# EasyEDA Pro project ProProject_Hi3861_v2.1_2024-07-26.epro, schematic Schematic2

## Sheets
1 P1: Create Date: 2024-07-16; Page Name: P1; Project Name: Hi3861_v2.1; Schematic Name: Schematic2; Update Date: 2024-07-25; Company: 嘉立创EDA; Page Size: A4; Version: V1.0
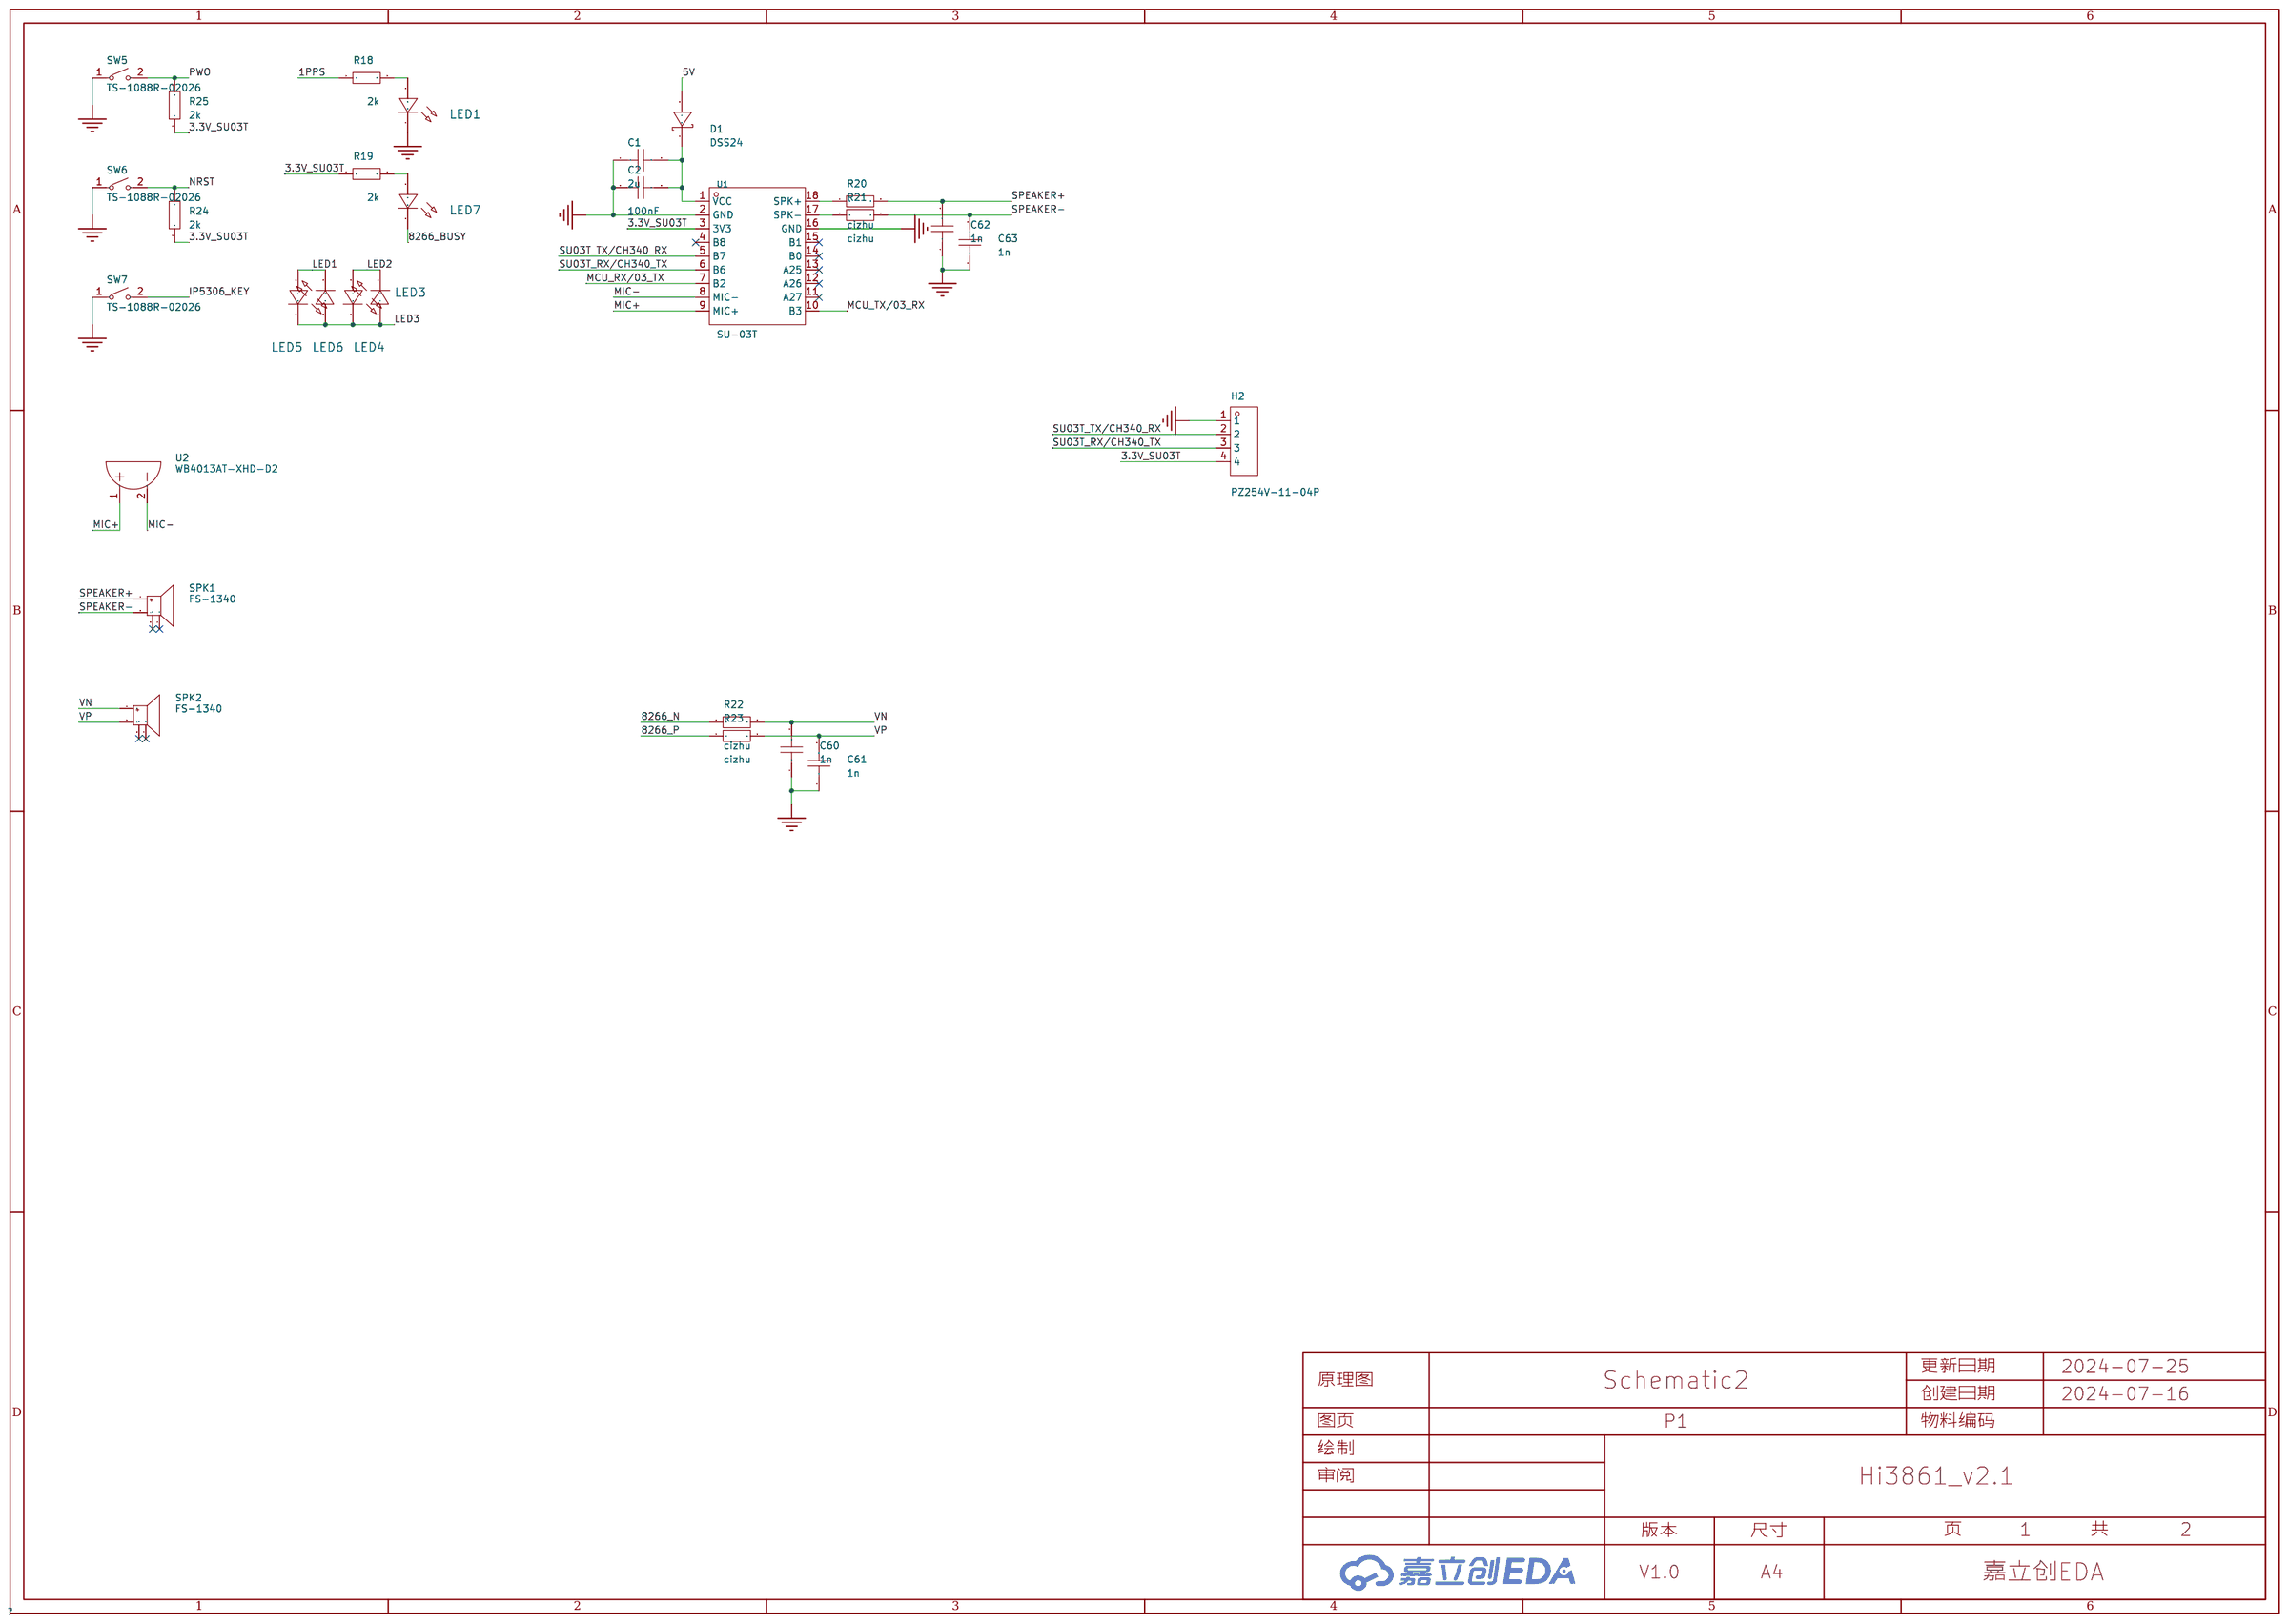
[diagram p2: P1]
2 P2: Page Name: P2
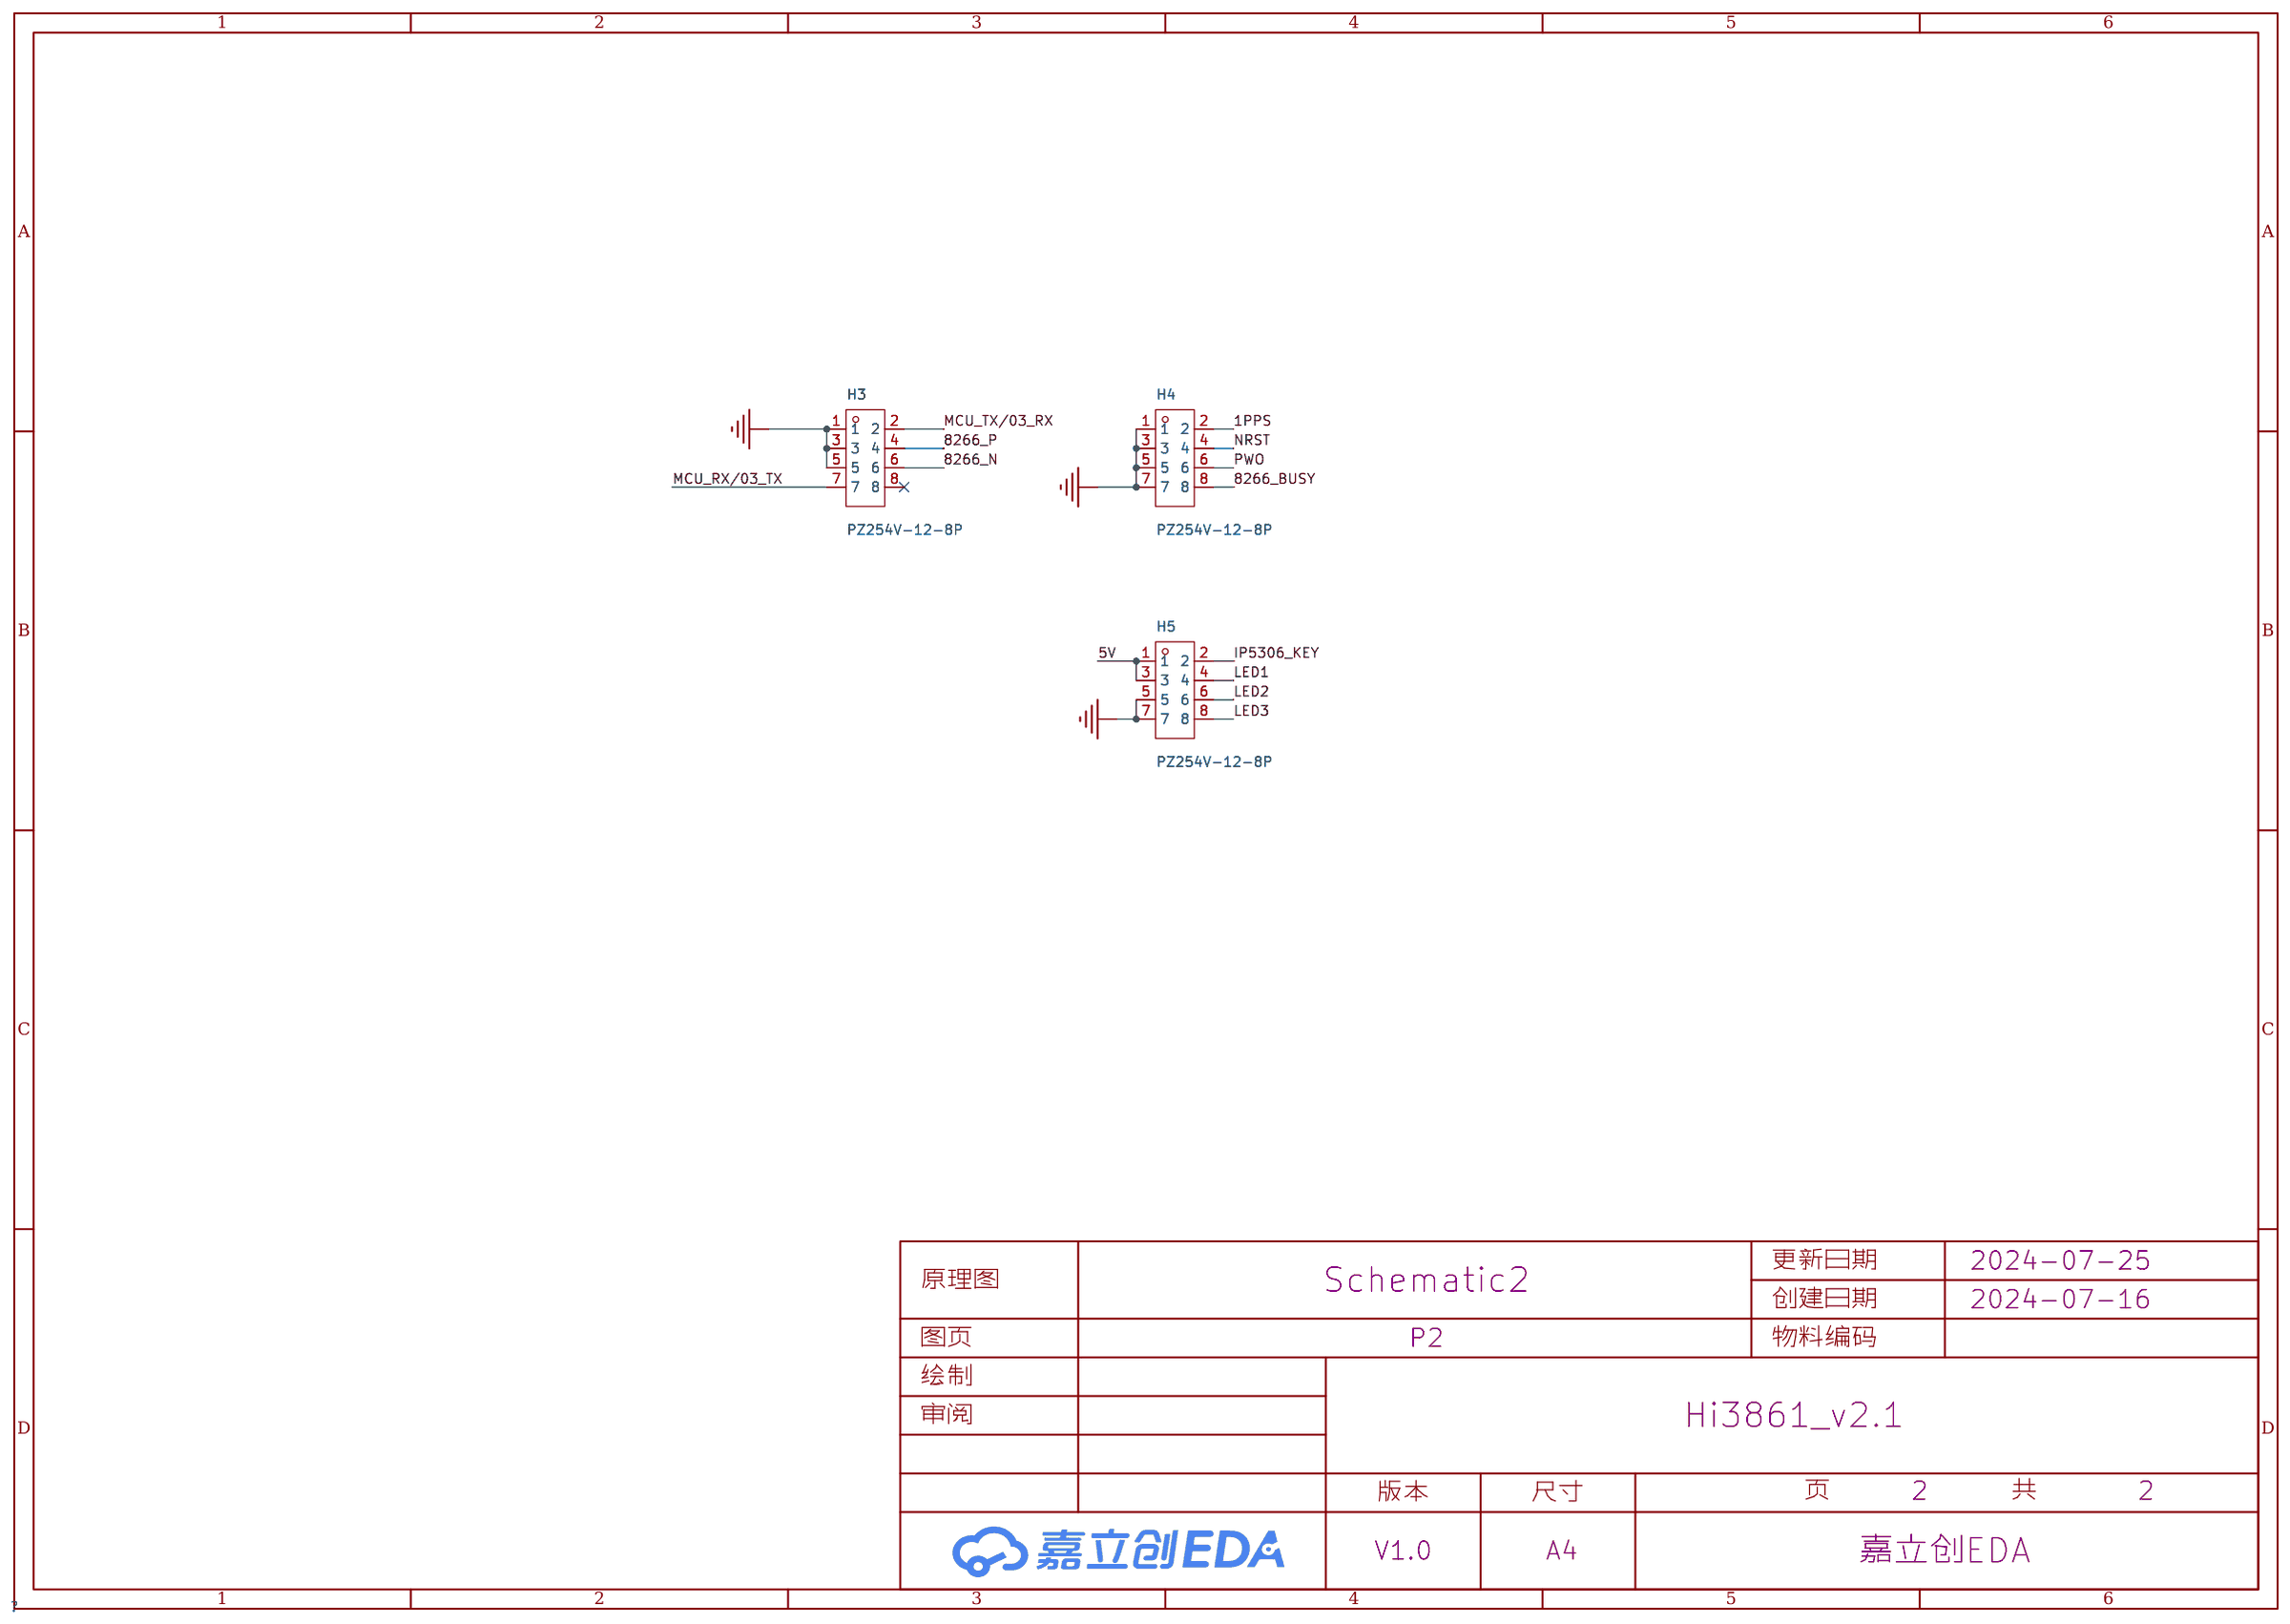
[diagram p3: P2]

## Parts
sheet P1
C1  2u  [C0402]
C2  100nF  [C0402]
C60  1n  [C0402]
C61  1n  [C0402]
C62  1n  [C0402]
C63  1n  [C0402]
D1  DSS24  [SOD-123_L2.8-W1.8-LS3.7-RD]
H2  PZ254V-11-04P  [HDR-TH_4P-P2.54-V-M]
LED1  -  [LED_0603]
LED3  -  [LED_0603]
LED4  -  [LED_0603]
LED5  -  [LED_0603]
LED6  -  [LED_0603]
LED7  -  [LED_0603]
R18  2k  [R0402]
R19  2k  [R0402]
R20  cizhu  [R0603]
R21  cizhu  [R0603]
R22  cizhu  [R0603]
R23  cizhu  [R0603]
R24  2k  [R0402]
R25  2k  [R0402]
SPK1  FS-1340  [BUZ-SMD_4P-L13.0-W13.0-P11.4-BL]
SPK2  FS-1340  [BUZ-SMD_4P-L13.0-W13.0-P11.4-BL]
SW5  TS-1088R-02026  [SW-SMD_L3.9-W3.0-P4.45]
SW6  TS-1088R-02026  [SW-SMD_L3.9-W3.0-P4.45]
SW7  TS-1088R-02026  [SW-SMD_L3.9-W3.0-P4.45]
U1  SU-03T  [COMM-SMD_18P-L21.0-W15.0-P2.00]
U2  WB4013AT-XHD-D2  [MIC-SMD_BD4.0_MIC.X-4013-SMD]
sheet P2
H3  PZ254V-12-8P  [HDR-TH_8P-P2.54-V-M-R2-C4-S2.54]
H4  PZ254V-12-8P  [HDR-TH_8P-P2.54-V-M-R2-C4-S2.54]
H5  PZ254V-12-8P  [HDR-TH_8P-P2.54-V-M-R2-C4-S2.54]

## Library data of the parts
C1 C2 C60-C63 = CAP_0402: Supplier Footprint: 0402
D1 = DSS24: 正向压降(Vf):550mV@2A;直流反向耐压(Vr):40V;平均整流电流(Io):2A;; LCSC Part Name: 电压:40V 电流:2A; Supplier Part: C511865; Manufacturer: BORN(伯恩半导体); Supplier Footprint: SOD-123; Datasheet: https://atta.szlcsc.com/upload/public/pdf/source/20200413/C511865_530A4A8DFA4BF76EA49400B00C28BC33.pdf; Supplier: LCSC; Forward Voltage (Vf@If): 550mV@2A; Reverse Voltage (Vr): 40V; Average Rectified Current (Io): 2A
H2 = PZ254V-11-04P: 插针结构:1x4P;间距:2.54mm;行距:-;圆针/方针:方针;安装类型:直插;排数:单排;总PIN位数:4P;额定电流:3A;额定电压:250V;配合针长度:6mm;塑高:2.5mm;端接针长度:3mm;触头材质:-;工作温度范围:-40℃~+105℃;颜色:黑色;; LCSC Part Name: 间距:2.54mm 1x4P 直插 方针; Supplier Part: C2691448; Manufacturer: XFCN(兴飞); Supplier Footprint: 插件,P=2.54mm; Datasheet: https://atta.szlcsc.com/upload/public/pdf/source/20200309/C492403_F9F19131791D08044AD4F84F8E751A34.pdf; Supplier: LCSC; Pin Structure: 1x4P; Pitch: 2.54mm; Circluar Pins/Square Pins: 方针; Mounting Type: 直插; Number of Rows: 单排; Number of Pins: 4P; Current Rating (Max): 3A; Voltage Rating (Max): 250V; Length of Mating Pin: 6mm; Insulation Height: 2.5mm; Length of End Connection Pin: 3mm; Operating Temperature Range: -40℃~+105℃; Color: 黑色
LED1 LED3-LED7 = LED_0603-R: Supplier Footprint: 0603
R18 R19 R24 R25 = Res_0402: Supplier Footprint: 0402
R20-R23 = Res_0603: Supplier Footprint: 0603
SPK1 SPK2 = FS-1340: LCSC Part Name: 喇叭13*13MM-4.0H 8Ω0.5W 贴片; Supplier Part: C482342; Manufacturer: FUET(福声科技); JLCPCB Part Class: 扩展库; Datasheet: https://atta.szlcsc.com/upload/public/pdf/source/20200113/C482342_9BDDCA56EED20E8AF6A7D6A5F1ED1CC9.pdf; Supplier: LCSC
SW5-SW7 = TS-1088R-02026: 电路结构:单刀单掷;按钮形状:圆形按钮;安装方式:立贴;开关长度:3.9mm;开关宽度:2.93mm;开关高度:2mm;触点电流:50mA;额定电压(DC):12V;带灯:-;机械寿命:-;; LCSC Part Name: 3.9*2.93*2mm 立贴 轻触开关; Supplier Part: C455280; Manufacturer: XUNPU(讯普); Supplier Footprint: SMD,3x4mm; Datasheet: https://atta.szlcsc.com/upload/public/pdf/source/20191118/C455281_EC5379764BC1462550DF64BBBFEA9579.pdf; Supplier: LCSC; Circuit: 单刀单掷; Actuator Style: 圆形按钮; Mounting Style: 立贴; Switch Length: 3.9mm; Switch Width: 2.93mm; Switch Height: 2mm; Contact Current: 50mA; Voltage Rating (DC): 12V
U1 = SU-03T: 处理器:-;运行内存:-;USB:-;WIFI协议:-;蓝牙:-;以太网:-;; Supplier Part: C879203; Manufacturer: MACHINE INTELLIGENCE(机芯智能); JLCPCB Part Class: 扩展库; Datasheet: https://atta.szlcsc.com/upload/public/pdf/source/20201029/C879203_F32AEAE676882DD706CDA0C6D57F9671.pdf; Supplier: LCSC
U2 = WB4013AT-XHD-D2: Supplier Part: C9900018114; Supplier Footprint: SMD; JLCPCB Part Class: 扩展库; Supplier: LCSC
H3-H5 = PZ254V-12-8P: 插针结构:2x4P;间距:2.54mm;行距:2.54mm;圆针/方针:方针;安装类型:直插;排数:双排;总PIN位数:8P;额定电流:-;额定电压:-;配合针长度:6mm;塑高:2.5mm;端接针长度:3mm;触头材质:黄铜;触头镀层:-;工作温度范围:-40℃~+105℃;颜色:黑色;; LCSC Part Name: 间距:2.54mm 2x4P 直插 方针; Supplier Part: C492421; Manufacturer: XFCN(兴飞); Supplier Footprint: 插件,P=2.54mm; Datasheet: https://atta.szlcsc.com/upload/public/pdf/source/20200309/C492421_DC8A206AF99CD7755BD4A5B0BC48200B.pdf; Supplier: LCSC; Pin Structure: 2x4P; Pitch: 2.54mm; Row Spacing: 2.54mm; Circluar Pins/Square Pins: 方针; Mounting Type: 直插; Number of Rows: 双排; Number of Pins: 8P; Length of Mating Pin: 6mm; Insulation Height: 2.5mm; Length of End Connection Pin: 3mm; Contact Material: 黄铜; Operating Temperature Range: -40℃~+105℃; Color: 黑色

## Nets
3.3V_SU03T: H2.4 R19.1 R24.1 R25.1 U1.3(3V3)
5V: D1.2(A) H5.1 H5.3
GND: C1.1 C2.1 C60.1 C61.1 C62.1 C63.1 H2.1 H3.1 H3.3 H3.5 H4.1 H4.3 H4.5 H4.7 H5.5 H5.7 LED1.1(C) SW5.1 SW6.1 SW7.1 U1.2(GND) U1.16(GND)
1PPS: H4.2 R18.1
8266_BUSY: H4.8 LED7.1(C)
8266_N: H3.6 R22.1
8266_P: H3.4 R23.1
IP5306_KEY: H5.2 SW7.2
LED1: H5.4 LED5.2(A) LED6.1(C)
LED2: H5.6 LED3.1(C) LED4.2(A)
LED3: H5.8 LED3.2(A) LED4.1(C) LED5.1(C) LED6.2(A)
MCU_RX/03_TX: H3.7 U1.7(B2)
MCU_TX/03_RX: H3.2 U1.10(B3)
MIC+: U1.9(MIC+) U2.1
MIC-: U1.8(MIC-) U2.2
NRST: H4.4 R24.2 SW6.2
PWO: H4.6 R25.2 SW5.2
SPEAKER+: C62.2 R20.2 SPK1.1(+)
SPEAKER-: C63.2 R21.2 SPK1.2(-)
SU03T_RX/CH340_TX: H2.3 U1.6(B6)
SU03T_TX/CH340_RX: H2.2 U1.5(B7)
VN: C60.2 R22.2 SPK2.1(+)
VP: C61.2 R23.2 SPK2.2(-)
$1N550: LED1.2(A) R18.2
$1N778: C1.2 C2.2 D1.1(C) U1.1(VCC)
$1N848: LED7.2(A) R19.2
$1N1553: R20.1 U1.18(SPK+)
$1N1585: R21.1 U1.17(SPK-)

Not connected (* = marked no-connect by the designer): H3 8*; SPK1 3* 4*; SPK2 3* 4*; U1 4(B8)* 11(A27)* 12(A26)* 13(A25)* 14(B0)* 15(B1)*
